# EAGLE design RPi_Extension_atx_power (EAGLE 8.6.3)
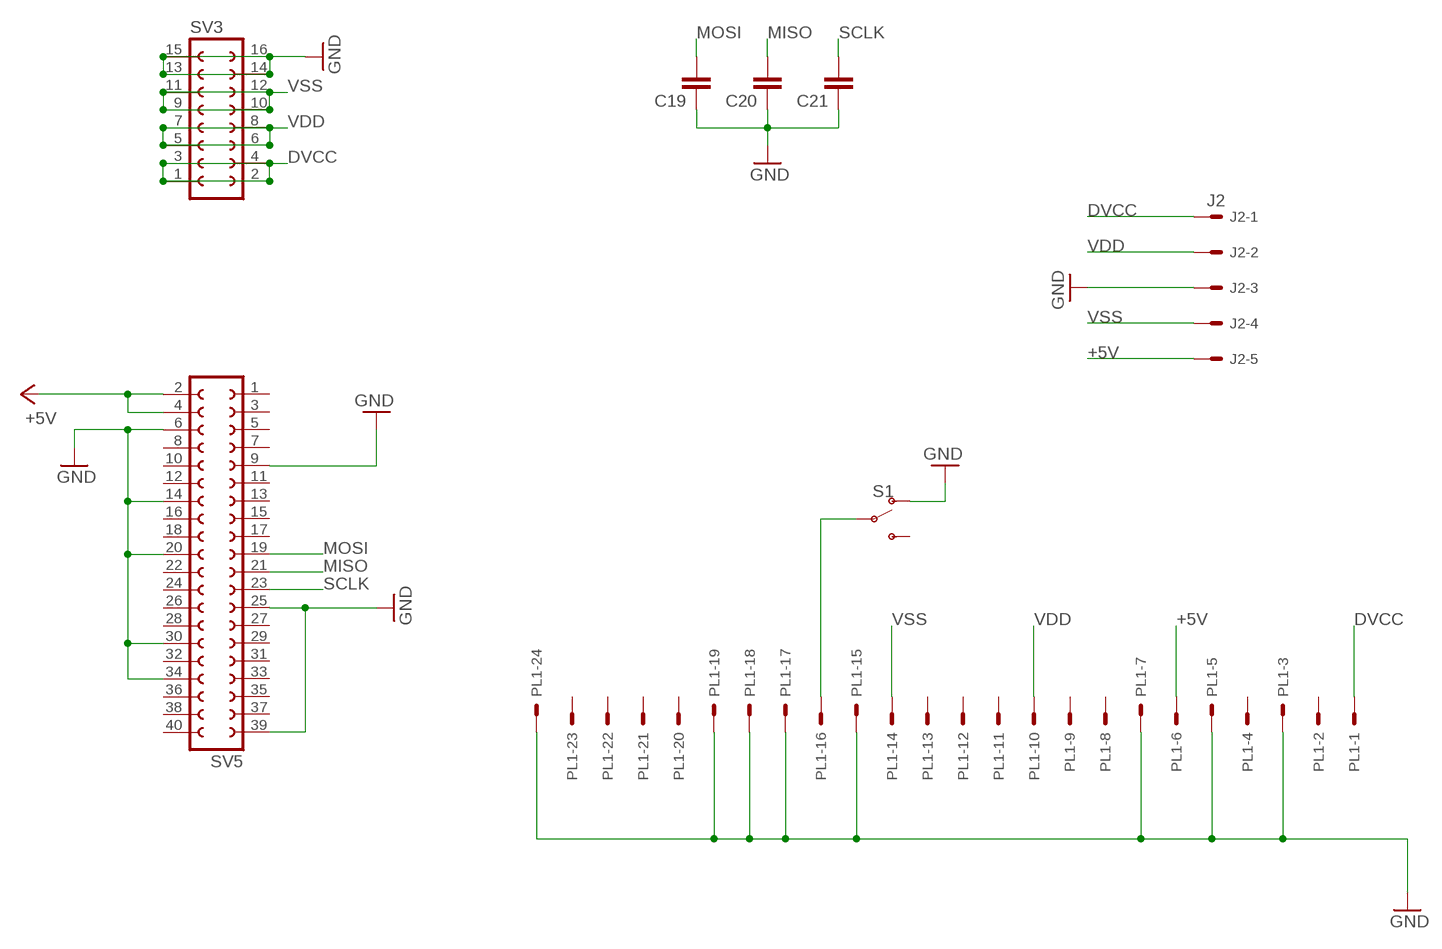
[diagram p0: schematic, sheet 1]

## Parts
C19  C-EUC0603  [C0603]
C20  C-EUC0603  [C0603]
C21  C-EUC0603  [C0603]
J2  J2  22-27-2051-05  [6410-05]
PL1  555X-24V  [5566-24]
S1  SWITCH-SPDT-PTH-11.6X4.0MM  [SWITCH_SPDT_PTH_11.6X4.0MM]
SV3  FE08-2  [FE08-2]
SV5  FE20-2  [FE20-2]

## Nets
+5V: J2.5 PL1.6 SV5.2 SV5.4
DVCC: J2.1 PL1.1 SV3.1 SV3.2 SV3.3 SV3.4
GND: C19.1 C20.1 C21.1 J2.3 PL1.3 PL1.5 PL1.7 PL1.15 PL1.17 PL1.18 PL1.19 PL1.24 S1.1(O) SV3.13 SV3.14 SV3.15 SV3.16 SV5.6 SV5.9 SV5.14 SV5.20 SV5.25 SV5.30 SV5.34 SV5.39
MISO: C20.2 SV5.21
MOSI: C19.2 SV5.19
N$2: PL1.16 S1.2(P)
SCLK: C21.2 SV5.23
VDD: J2.2 PL1.10 SV3.5 SV3.6 SV3.7 SV3.8
VSS: J2.4 PL1.14 SV3.9 SV3.10 SV3.11 SV3.12
Unconnected: PL1.2 PL1.4 PL1.8 PL1.9 PL1.11 PL1.12 PL1.13 PL1.20 PL1.21 PL1.22 PL1.23 S1.3(S) SV5.1 SV5.3 SV5.5 SV5.7 SV5.8 SV5.10 SV5.11 SV5.12 SV5.13 SV5.15 SV5.16 SV5.17 SV5.18 SV5.22 SV5.24 SV5.26 SV5.27 SV5.28 SV5.29 SV5.31 SV5.32 SV5.33 SV5.35 SV5.36 SV5.37 SV5.38 SV5.40

## Library data of the parts
C19-C21 = rcl:C-EU: CAPACITOR, European symbol
J2 = con-molex:22-?-05: CONNECTOR wire to board 2.54 mm (.1 inch) pitch header; OC_FARNELL: unknown; OC_NEWARK: unknown
PL1 = con-molex-2:555X-24: Mini FIT connector 24 way
S1 = SparkFun-Switches:SWITCH-SPDT: Single Pole, Double Throw (SPDT) Switch Single-pole, double-throw (SPDT) switch. Variant Overview SMD-AYZ0202 Surface Mount DPDT Switch <https://www.sparkfun.com/products/597> (COM-00597) Used on e.g. LilyPad Arduino USB - ATmega32U4 Board <https://www.sparkfun.com/products/12049> PTH-11.6X4.0MM SPDT Mini Power Switch <https://www.sparkfun.com/products/102> (COM-00102) Used on e.g. SparkFun Simon Says - Through-Hole Soldering Kit <https://www.sparkfun.com/products/10547> (KIT-10547) PTH-11.6X4.0MM-KIT KIT version of SPDT Mini Power Switch - Simplifies soldering by removing tStop of switch pins - only one side can be soldered. PTH-11.6X4.0MM-LOCK LOCK version of SPDT Mini Power Switch - Offset pins hold switch in place for easier soldering. SMD-RIGHT-ANGLE Surface Mount Right Angle Switch <https://www.sparkfun.com/products/10860> (COM-10860) Used on e.g. SparkFun ESP8266 Thing <https://www.sparkfun.com/products/13231>; PROD_ID: SWCH-08261; SF_SKU: COM-00102
SV3 = con-lsta:FE08-2: FEMALE HEADER; OC_FARNELL: unknown; OC_NEWARK: unknown
SV5 = con-lsta:FE20-2: FEMALE HEADER; OC_FARNELL: unknown; OC_NEWARK: unknown

## Board
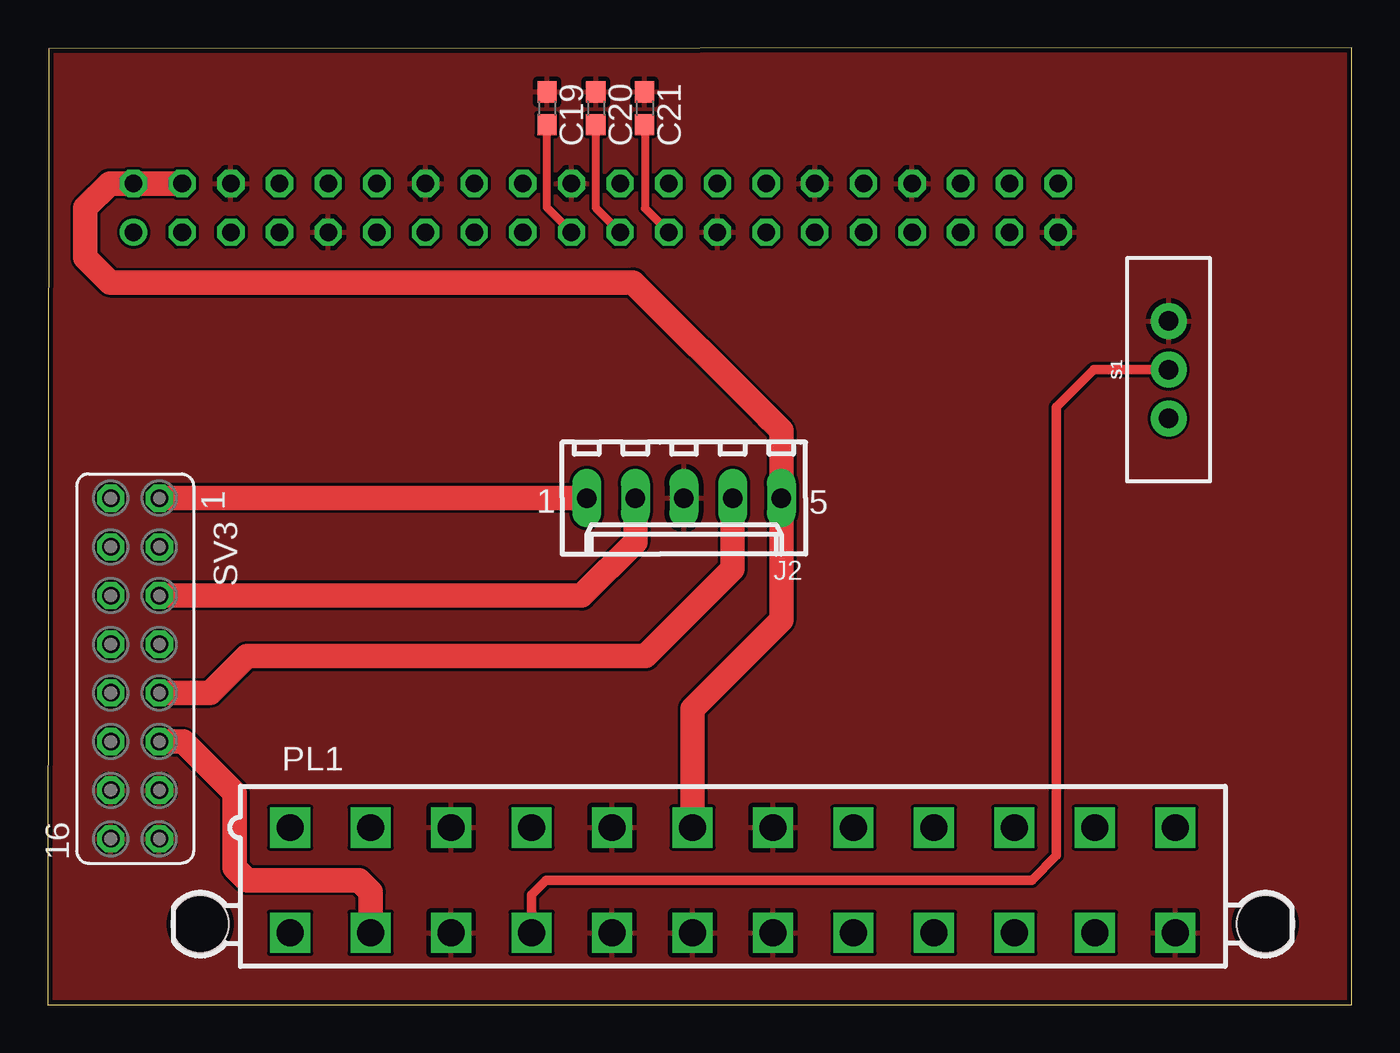
[diagram p1: board, top side]
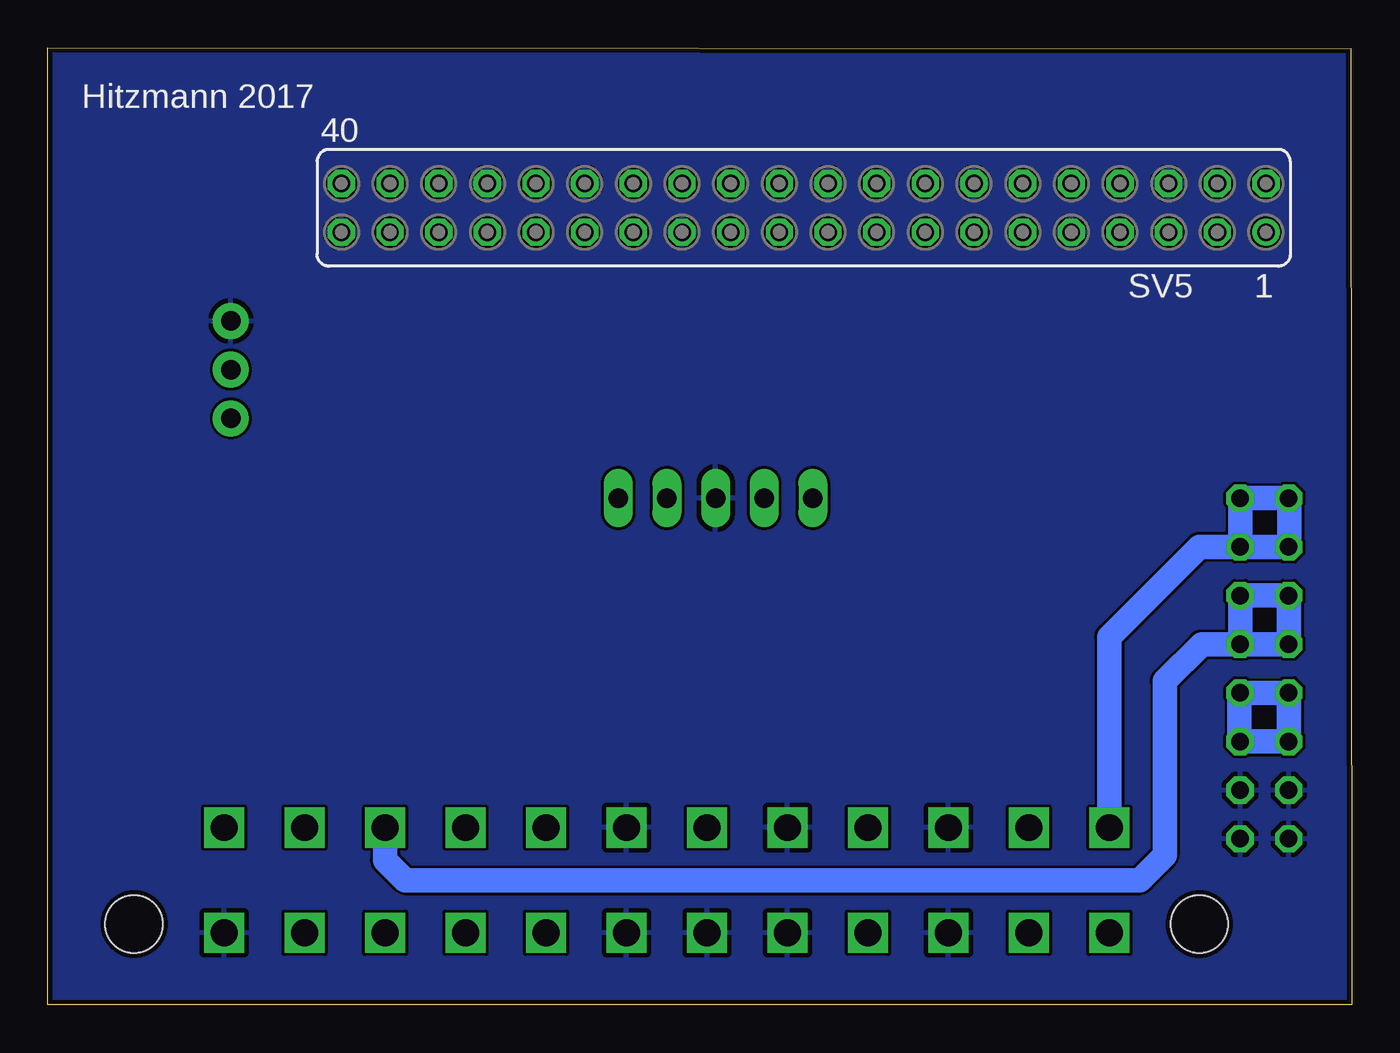
[diagram p2: board, bottom side, seen from below]

Size 68.05 x 49.95 mm. Coordinates in mm from the lower left corner, seen from the top.
Outline: 0,0 68.05,0 68.05,49.95 0.05,49.9 0,0
Copper layers (1*16): Top 0.035mm / dielectric 1.5mm / Bottom 0.035mm
Design rules "dirt_cheap_dirty_boards.v1.1": minimum track width 6mil, minimum drill 12mil, track to track 6mil, track to pad 6mil, pad to pad 6mil, via to via 6mil, smd to smd 0mil, copper to edge 10mil, drill to drill 10mil, minimum pad ring 10mil, minimum via ring 6mil, stop-mask expansion 2mil, vias tented up to drill 25mil, thermal gap 10mil

### Footprints (pad centres in the part's own frame; a part is rotated, then mirrored left to right if it is on the bottom)
C0603 = smd 1.1 x 1: 1 -0.85,0; 2 0.85,0
6410-05 = drill 1.016 long: 1 5.08,0; 2 2.54,0; 3 0,0; 4 -2.54,0; 5 -5.08,0
5566-24 = drill 1.4 square: 1 23.1,-2.75; 2 18.9,-2.75; 3 14.7,-2.75; 4 10.5,-2.75; 5 6.3,-2.75; 6 2.1,-2.75; 7 -2.1,-2.75; 8 -6.3,-2.75; 9 -10.5,-2.75; 10 -14.7,-2.75; 11 -18.9,-2.75; 12 -23.1,-2.75; 13 23.1,2.75; 14 18.9,2.75; 15 14.7,2.75; 16 10.5,2.75; 17 6.3,2.75; 18 2.1,2.75; 19 -2.1,2.75; 20 -6.3,2.75; 21 -10.5,2.75; 22 -14.7,2.75; 23 -18.9,2.75; 24 -23.1,2.75 | hole 3: 27.8,2.29; -27.8,2.29
SWITCH_SPDT_PTH_11.6X4.0MM = drill 1.016 pad 1.88: 1 0,2.54; 2 0,0; 3 0,-2.54
FE08-2 = drill 0.914 octagon: 1 -8.89,1.27; 2 -8.89,-1.27; 3 -6.35,1.27; 4 -6.35,-1.27; 5 -3.81,1.27; 6 -3.81,-1.27; 7 -1.27,1.27; 8 -1.27,-1.27; 9 1.27,1.27; 10 1.27,-1.27; 11 3.81,1.27; 12 3.81,-1.27; 13 6.35,1.27; 14 6.35,-1.27; 15 8.89,1.27; 16 8.89,-1.27
FE20-2 = drill 0.914: 1 -24.13,1.27 | drill 0.914 octagon: 2 -24.13,-1.27; 3 -21.59,1.27; 4 -21.59,-1.27; 5 -19.05,1.27; 6 -19.05,-1.27; 7 -16.51,1.27; 8 -16.51,-1.27; 9 -13.97,1.27; 10 -13.97,-1.27; 11 -11.43,1.27; 12 -11.43,-1.27; 13 -8.89,1.27; 14 -8.89,-1.27; 15 -6.35,1.27; 16 -6.35,-1.27; 17 -3.81,1.27; 18 -3.81,-1.27; 19 -1.27,1.27; 20 -1.27,-1.27; 21 1.27,1.27; 22 1.27,-1.27; 23 3.81,1.27; 24 3.81,-1.27; 25 6.35,1.27; 26 6.35,-1.27; 27 8.89,1.27; 28 8.89,-1.27; 29 11.43,1.27; 30 11.43,-1.27; 31 13.97,1.27; 32 13.97,-1.27; 33 16.51,1.27; 34 16.51,-1.27; 35 19.05,1.27; 36 19.05,-1.27; 37 21.59,1.27; 38 21.59,-1.27; 39 24.13,1.27; 40 24.13,-1.27

### Placement (x,y rotation side)
C19  26.05,46.8 270 top
C20  28.6,46.8 270 top
C21  31.15,46.8 270 top
J2  33.2,26.45 180 top
PL1  35.75,6.5 180 top
S1  58.5,33.15 0 top
SV3  4.55,17.55 270 top
SV5  28.6,41.6 180 bottom

### Tracks (layer width: path | path; a pad name or v marks a point on that pad's centre or on a via)
+5V
  Top 1.27: 37.38,30.88 30.55,37.7 3.25,37.7 1.95,39 1.95,41.6 3.22,42.87 SV5.2 SV5.4 | 37.38,30.88 37.7,30.55 | 37.38,30.88 38.28,29.97 J2.5 38.28,20.08 33.65,15.45 PL1.6
DVCC
  Top 0.61: SV3.1 5.85,26.47 | 3.25,26.47 SV3.2
  Top 1.27: J2.1 SV3.1
  Bottom 0.406: SV3.2 SV3.1
  Bottom 1.27: SV3.3 SV3.1 3.25,26.44 3.25,24.05 | SV3.3 SV3.4 | SV3.3 7.95,23.9 12.65,19.2 PL1.1
GND
  pour Top: -0.65,-0.65 68.7,-0.65 68.7,50.7 -0.65,50.7
  pour Bottom: 0,0 0,50.05 68.05,50.05 68.05,0
MISO
  Top 0.406: SV5.21 28.61,41.59 28.61,45.94 C20.2
MOSI
  Top 0.406: SV5.19 26.05,41.61 C19.2
N$2
  Top 0.508: S1.2 54.6,33.15 52.65,31.2 52.65,7.8 51.35,6.5 26,6.5 25.25,5.75 PL1.16
SCLK
  Top 0.406: SV5.23 31.16,41.58 31.16,45.94 C21.2
VDD
  Top 1.27: J2.2 30.66,24.16 27.86,21.36 SV3.5
  Bottom 1.27: PL1.10 50.45,7.55 49.4,6.5 11.05,6.5 9.75,7.8 9.75,16.9 7.83,18.82 SV3.7 | SV3.7 SV3.8 SV3.6 SV3.5 SV3.7
VSS
  Top 0.406: 5.82,16.3 SV3.9
  Top 1.27: SV3.9 8.48,16.28 10.4,18.2 31.2,18.2 35.74,22.74 J2.4 | SV3.11 7.06,13.74 9.75,11.05 9.75,7.15 10.4,6.5 16.25,6.5 16.85,5.9 PL1.14
  Bottom 0.406: SV3.9 5.85,16.28 | 5.82,13.65 SV3.11
  Bottom 1.27: SV3.9 SV3.10 SV3.12 SV3.11 | 5.85,16.28 5.85,13.75

### Text on the board
bNames: Hitzmann 2017